# EAGLE design Test Board (EAGLE 6.5.0)
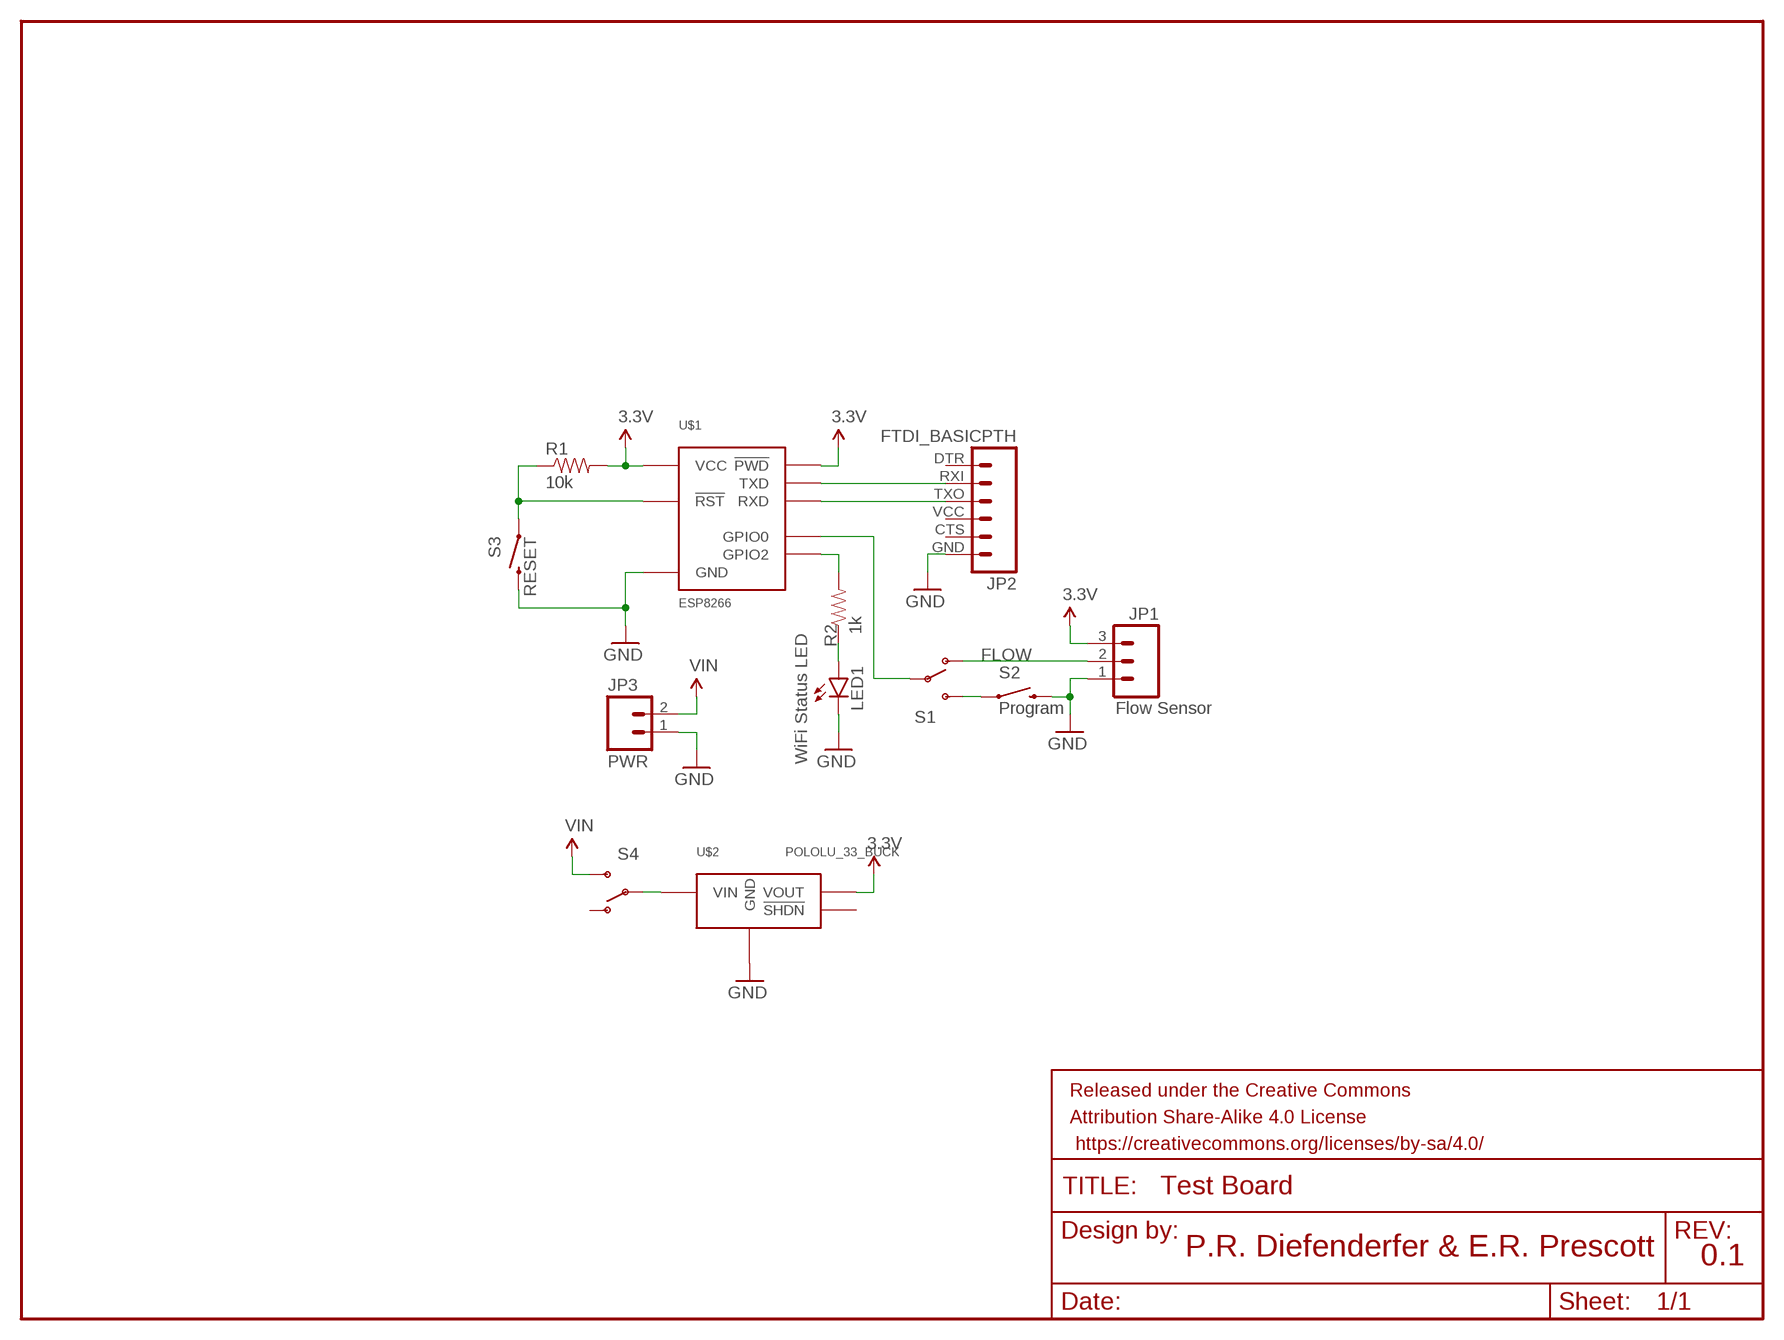
[diagram p0: schematic, sheet 1]

## Parts
FRAME1  FRAME-LETTER  [CREATIVE_COMMONS]
JP1  Flow Sensor  M03LOCK  [1X03_LOCK]
JP2  FTDI_BASICPTH  [FTDI_BASIC]
JP3  PWR  M02LOCK  [1X02_LOCK]
LED1  WiFi Status LED  LED-3MM-NO_SILK  [LED3MM-NS]
R1  10k  RESISTORAXIAL-0.3  [AXIAL-0.3]
R2  1k  RESISTORAXIAL-0.3  [AXIAL-0.3]
S1  SWITCH-SPDTPTH  [SWITCH-SPDT]
S2  Program  SWITCH-MOMENTARY-2PTH  [TACTILE-PTH]
S3  RESET  SWITCH-MOMENTARY-2PTH  [TACTILE-PTH]
S4  SWITCH-SPDTPTH  [SWITCH-SPDT]
U$1  ESP8266  ESP8266_R3  [2X4_LOCK]
U$2  POLOLU_33_BUCK  [1X4_LOCK]

## Nets
3.3V: JP1.3 R1.P$2 U$1.CH_PD(!PWD) U$1.VCC U$2.VOUT
FLOW: JP1.2 S1.1(O)
GND: JP1.1 JP2.GND JP3.1 LED1.K(C) S2.3 S3.3 U$1.GND U$2.GND
N$1: S1.3(S) S2.1
N$2: JP2.RXI U$1.TXD
N$3: R1.P$1 S3.1 U$1.RST(!RST)
N$4: JP2.TXO U$1.RXD
N$5: LED1.A R2.P$1
N$6: R2.P$2 U$1.GPIO2
N$7: S1.2(P) U$1.GPIO0
N$8: S4.2(P) U$2.VIN
VIN: JP3.2 S4.3(S)
Unconnected: JP2.CTS JP2.DTR JP2.VCC S4.1(O) U$2.!SHDN

## Notes on the sheet
- P.R. Diefenderfer & E.R. Prescott
- 0.1

## Library data of the parts
FRAME1 = SparkFun-Aesthetics:FRAME-LETTER: Schematic Frame Standard 8.5x11 US Letter frame
JP1 = SparkFun-Connectors:M03: Header 3 Standard 3-pin 0.1" header. Use with straight break away headers (SKU : PRT-00116), right angle break away headers (PRT-00553), swiss pins (PRT-00743), machine pins (PRT-00117), and female headers (PRT-00115). Molex polarized connector foot print use with SKU : PRT-08232 with associated crimp pins and housings.
JP2 = SparkFun-Connectors:FTDI_BASIC: FTDI Basic header with labels
JP3 = SparkFun-Connectors:M02: Standard 2-pin 0.1" header. Use with - straight break away headers ( PRT-00116) - right angle break away headers (PRT-00553) - swiss pins (PRT-00743) - machine pins (PRT-00117) - female headers (PRT-00115) Molex polarized connector foot print use with: PRT-08233 with associated crimp pins and housings. 2.54_SCREWTERM for use with PRT-10571. 3.5mm Screw Terminal footprints for PRT-08084 5mm Screw Terminal footprints for use with PRT-08433
LED1 = SparkFun-LED:LED: LEDs Standard schematic elements and footprints for 5mm, 3mm, 1206, and 0603 sized LEDs. 5mm - Spark Fun Electronics SKU : COM-00529 (and others)
R1 R2 = SparkFun-Resistors:RESISTOR: Resistor Basic schematic elements and footprints for 0603, 1206, and PTH resistors.
S1 S4 = SparkFun-Electromechanical:SWITCH-SPDT: SPDT Switch Simple slide switch, Spark Fun Electronics SKU : COM-00102 DPDT SMT slide switch, AYZ0202, SWCH-08179
S2 S3 = SparkFun-Electromechanical:SWITCH-MOMENTARY-2: Various NO switches- pushbuttons, reed, etc
U$1 = dCustom:ESP8266_R3
U$2 = dCustom:POLOLU_33_BUCK

## Board
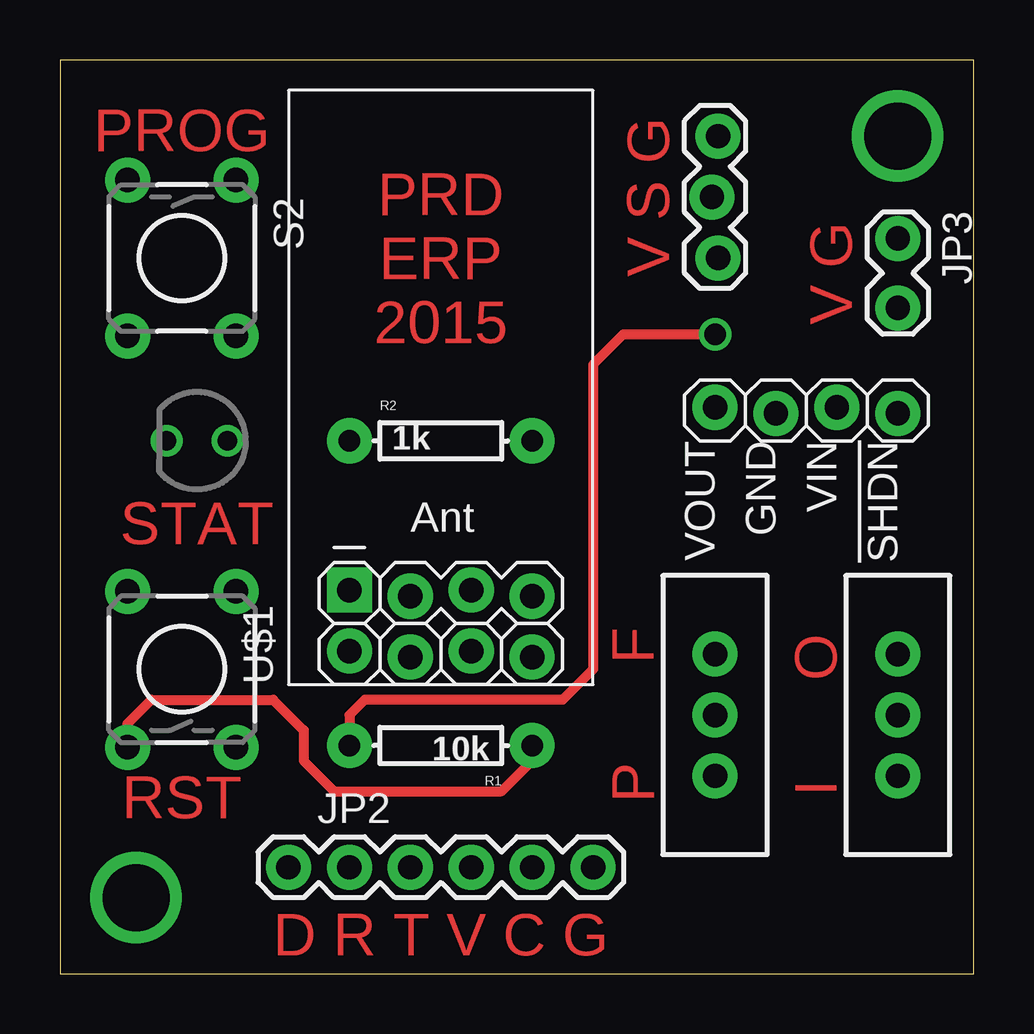
[diagram p1: board, top side]
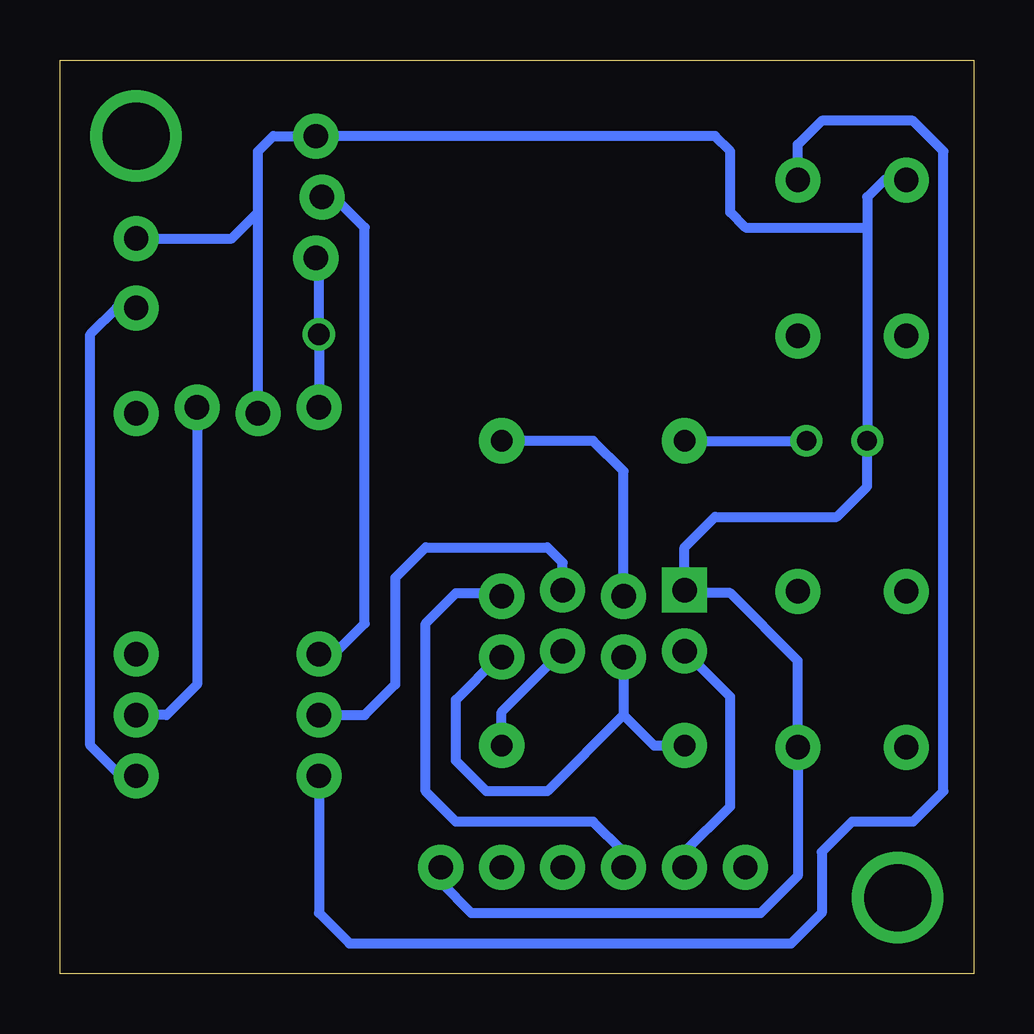
[diagram p2: board, bottom side, seen from below]

Size 38.1 x 38.1 mm. Coordinates in mm from the lower left corner, seen from the top.
Outline: 0,0 38.1,0 38.1,38.1 0,38.1 0,0
Copper layers (1*16): Top 0.035mm / dielectric 1.5mm / Bottom 0.035mm
Design rules "default": minimum track width 10mil, minimum drill 24mil, track to track 8mil, track to pad 8mil, pad to pad 8mil, via to via 8mil, smd to smd 8mil, copper to edge 40mil, drill to drill 8mil, minimum pad ring 10mil, minimum via ring 8mil, stop-mask expansion 4mil, vias tented up to drill 0mil, thermal gap 10mil

### Footprints (pad centres in the part's own frame; a part is rotated, then mirrored left to right if it is on the bottom)
1X03_LOCK = drill 1.016 pad 1.88: 1 0,0.127; 2 2.54,-0.127; 3 5.08,0.127
FTDI_BASIC = drill 1.016 pad 1.88: CTS 10.16,0; DTR 0,0; GND 12.7,0; RXI 2.54,0; TXO 5.08,0; VCC 7.62,0
1X02_LOCK = drill 1.016 pad 1.88: 1 -0.178,0; 2 2.718,0
LED3MM-NS = drill 0.813: A -1.27,0; K 1.27,0
AXIAL-0.3 = drill 0.9 pad 1.88: P$1 -3.81,0; P$2 3.81,0
SWITCH-SPDT = drill 1.016 pad 1.88: 1 0,2.54; 2 0,0; 3 0,-2.54
TACTILE-PTH = drill 1.016 pad 1.88: 1 -3.251,2.261; 2 3.251,2.261; 3 -3.251,-2.261; 4 3.251,-2.261
2X4_LOCK = drill 1.016 pad 1.88: CH_PD 5.08,1.143; GPIO0 7.62,3.937; GPIO2 5.08,3.683; RST 7.62,1.397; RXD 10.16,3.683; TXD 2.54,1.397; VCC 10.16,1.143 | drill 1.016 pad 1.88 square: GND 2.54,3.937
1X4_LOCK = drill 1.016 pad 1.88: !SHDN 7.62,-0.127; GND 2.54,-0.127; VIN 5.08,0.127; VOUT 0,0.127

### Placement (x,y rotation side)
FRAME1  -1.27,-12.06 0 top  (outside the outline)
JP1  27.3,34.92 270 top
JP2  9.53,4.45 0 top
JP3  34.92,30.48 270 top
LED1  5.71,22.23 180 top
R1  15.88,9.53 180 top
R2  15.88,22.23 0 top
S1  27.3,10.79 0 top
S2  5.08,29.84 270 top
S3  5.08,12.7 90 top
S4  34.92,10.79 0 top
U$1  9.53,12.06 0 top
U$2  27.3,23.5 0 top

### Tracks (layer width: path | path; a pad name or v marks a point on that pad's centre or on a via)
3.3V  (via drill 0.9)
  Top 0.406: v27.3,26.67 23.5,26.67 22.23,25.4 22.23,12.7 20.95,11.43 12.7,11.43 12.06,10.79 R1.P$2
  Bottom 0.406: 14.61,10.79 13.34,9.53 R1.P$2 | U$1.CH_PD 14.61,10.79 | 14.61,10.79 17.78,7.62 20.32,7.62 21.59,8.89 21.59,11.43 19.81,13.21 U$1.VCC | JP1.3 27.3,29.72 v27.3,26.67 U$2.VOUT
FLOW
  Bottom 0.406: S1.1 26.67,13.34 25.4,14.61 25.4,31.11 26.67,32.38 JP1.2
GND
  Bottom 0.406: S2.3 3.73,33.1 4.45,32.38 4.45,31.11 | 4.45,31.11 LED1.K 4.45,20.32 5.71,19.05 10.79,19.05 12.06,17.78 U$1.GND 11.94,15.88 10.16,15.88 7.34,13.06 S3.3 7.34,4.09 8.89,2.54 20.95,2.54 22.23,3.81 JP2.GND 22.23,5.08 | 4.45,31.11 9.53,31.11 10.16,31.75 10.16,34.29 10.79,34.92 JP1.1 29.21,34.92 29.84,34.29 29.84,31.75 | U$2.GND 29.84,31.75 | JP3.1 30.94,30.66 29.84,31.75
N$1
  Bottom 0.406: S1.3 27.3,2.54 26.04,1.27 7.62,1.27 6.35,2.54 6.35,5.08 5.08,6.35 2.54,6.35 1.27,7.62 1.27,34.29 2.54,35.56 6.35,35.56 7.34,34.57 S2.1
N$2
  Bottom 0.406: JP2.RXI 12.06,5.08 10.16,6.99 10.16,11.56 U$1.TXD
N$3
  Top 0.406: R1.P$1 19.68,8.89 18.41,7.62 11.43,7.62 10.16,8.89 10.16,10.16 8.89,11.43 3.81,11.43 2.82,10.44 S3.1
  Bottom 0.406: R1.P$1 19.68,10.92 U$1.RST
N$4
  Bottom 0.406: JP2.TXO 14.61,5.08 15.88,6.35 21.59,6.35 22.86,7.62 22.86,14.61 21.59,15.88 19.81,15.88 U$1.RXD
N$5
  Bottom 0.406: R2.P$1 LED1.A
N$6
  Bottom 0.406: U$1.GPIO2 14.61,20.95 15.88,22.23 R2.P$2
N$7
  Bottom 0.406: U$1.GPIO0 17.14,17.14 17.78,17.78 22.86,17.78 24.13,16.51 24.13,12.06 25.4,10.79 S1.2
N$8
  Bottom 0.406: U$2.VIN 32.38,12.06 33.66,10.79 S4.2
N$9  (via drill 2.8)
  other vias: 34.92,34.92
N$12  (via drill 2.8)
  other vias: 3.17,3.17
VIN
  Bottom 0.406: S4.3 35.56,8.26 36.83,9.53 36.83,26.67 35.74,27.76 JP3.2

### Text on the board
Top: PROG | V S G | PRD / ERP / 2015 | V G | STAT | P F | I O | RST | D R T V C G
tDocu: P.R.Diefenderfer & E.R. Prescott